# Altium schematic sheet EDU_High-Speed-Design_DDR3.SchDoc: DDR3
size 558 x 431 mm; Date: not used; ApprovedBy: not used; CheckedBy: not used; Author: not used; DrawnBy: not used; Organization: not used; Address4: not used; SheetNumber: 7; SheetTotal: 26; Time: not used; ImagePath: not used; Application_BuildNumber: not used
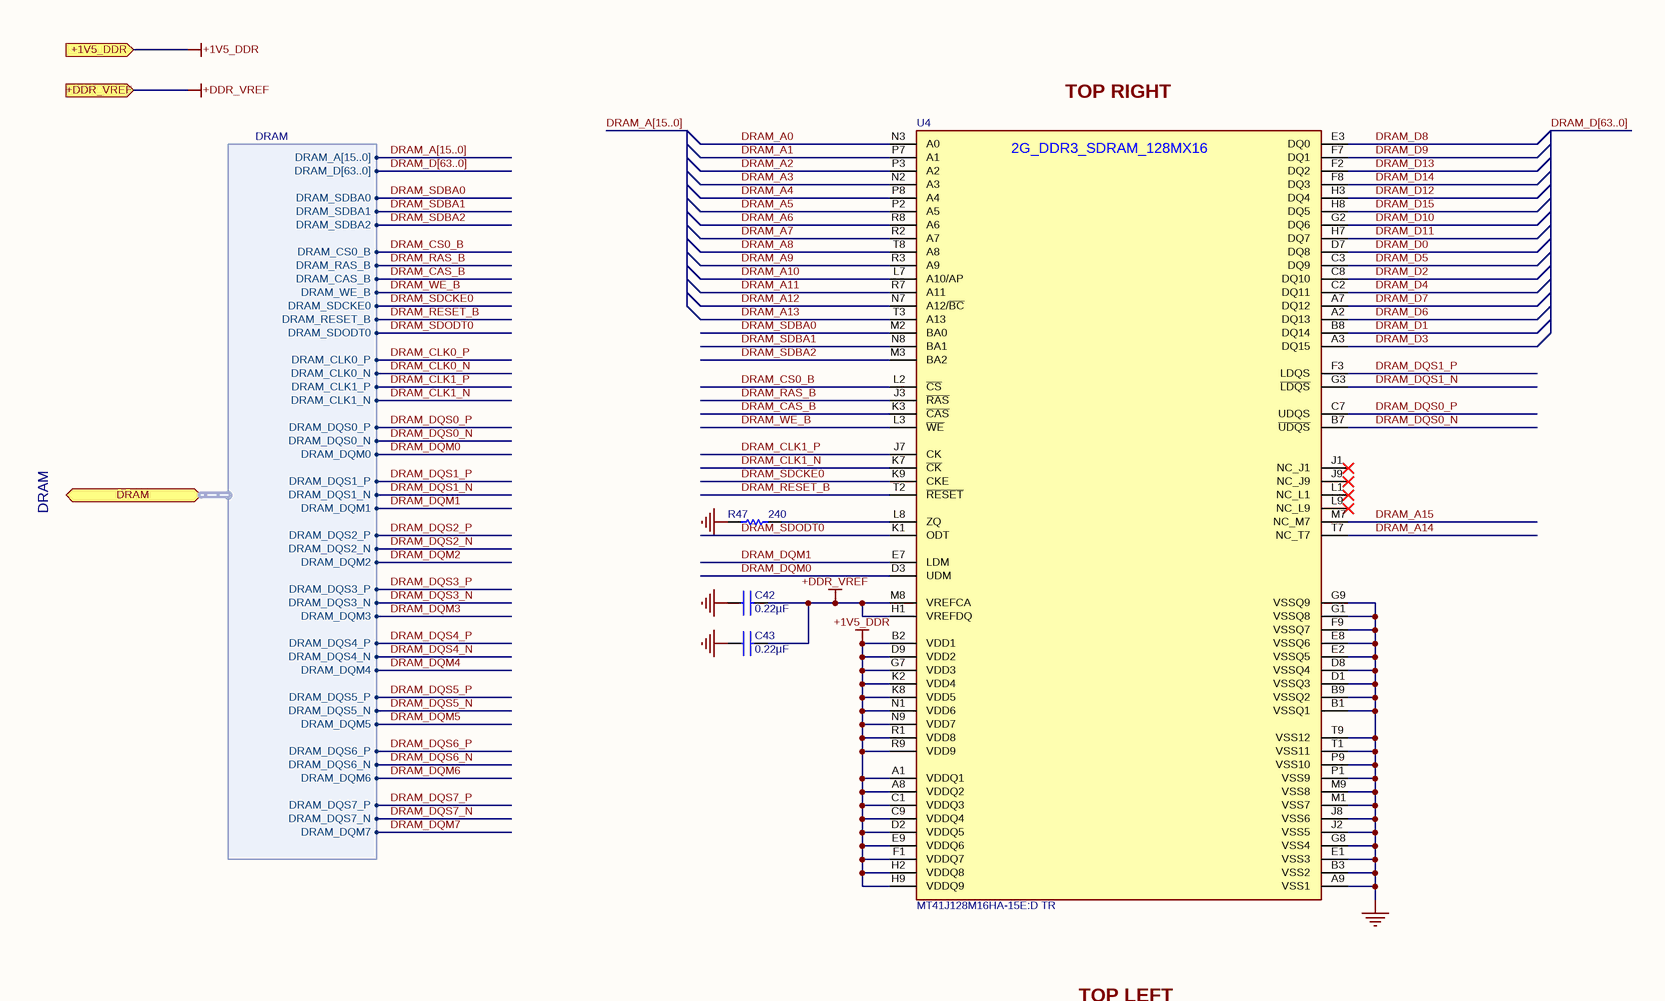
[diagram p0: EDU_High-Speed-Design_DDR3.SchDoc, top left]
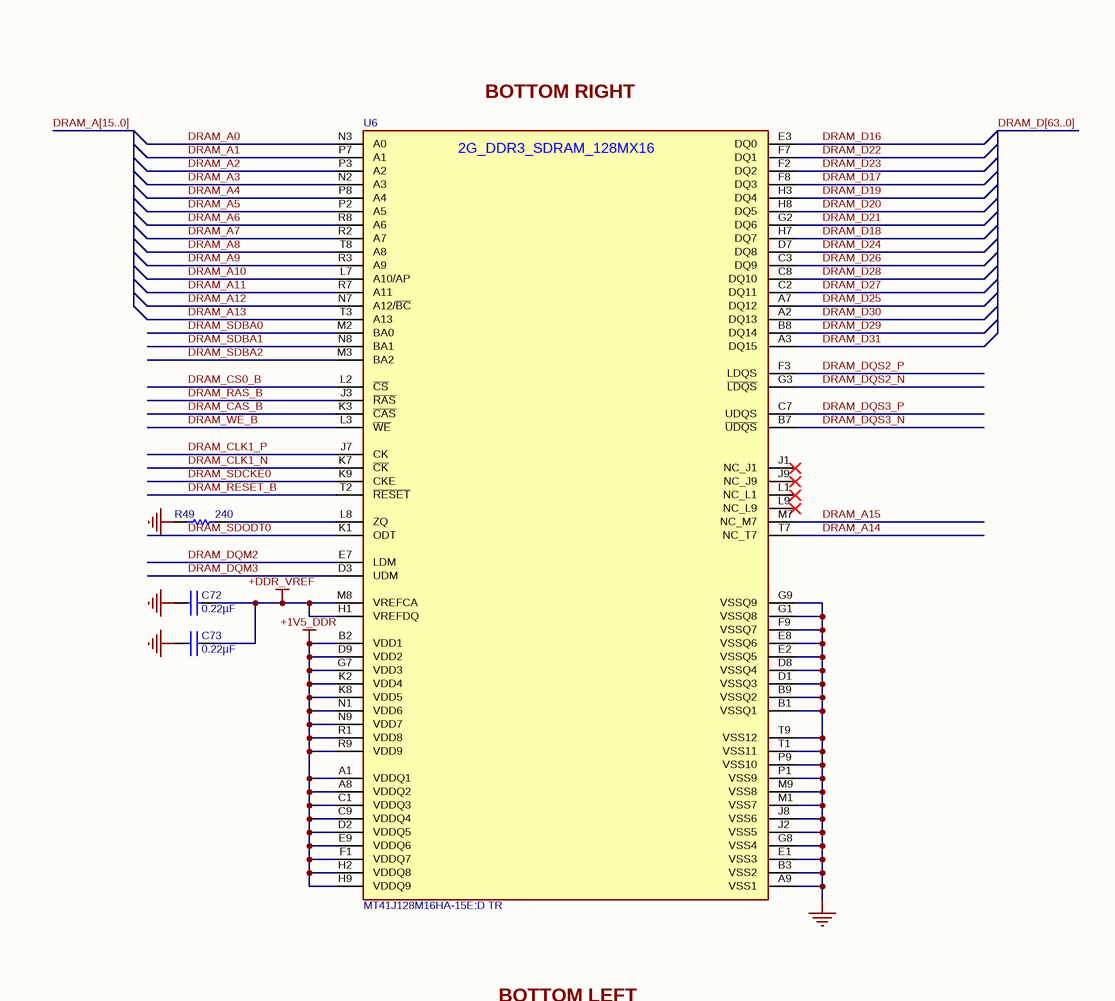
[diagram p1: EDU_High-Speed-Design_DDR3.SchDoc, top right]
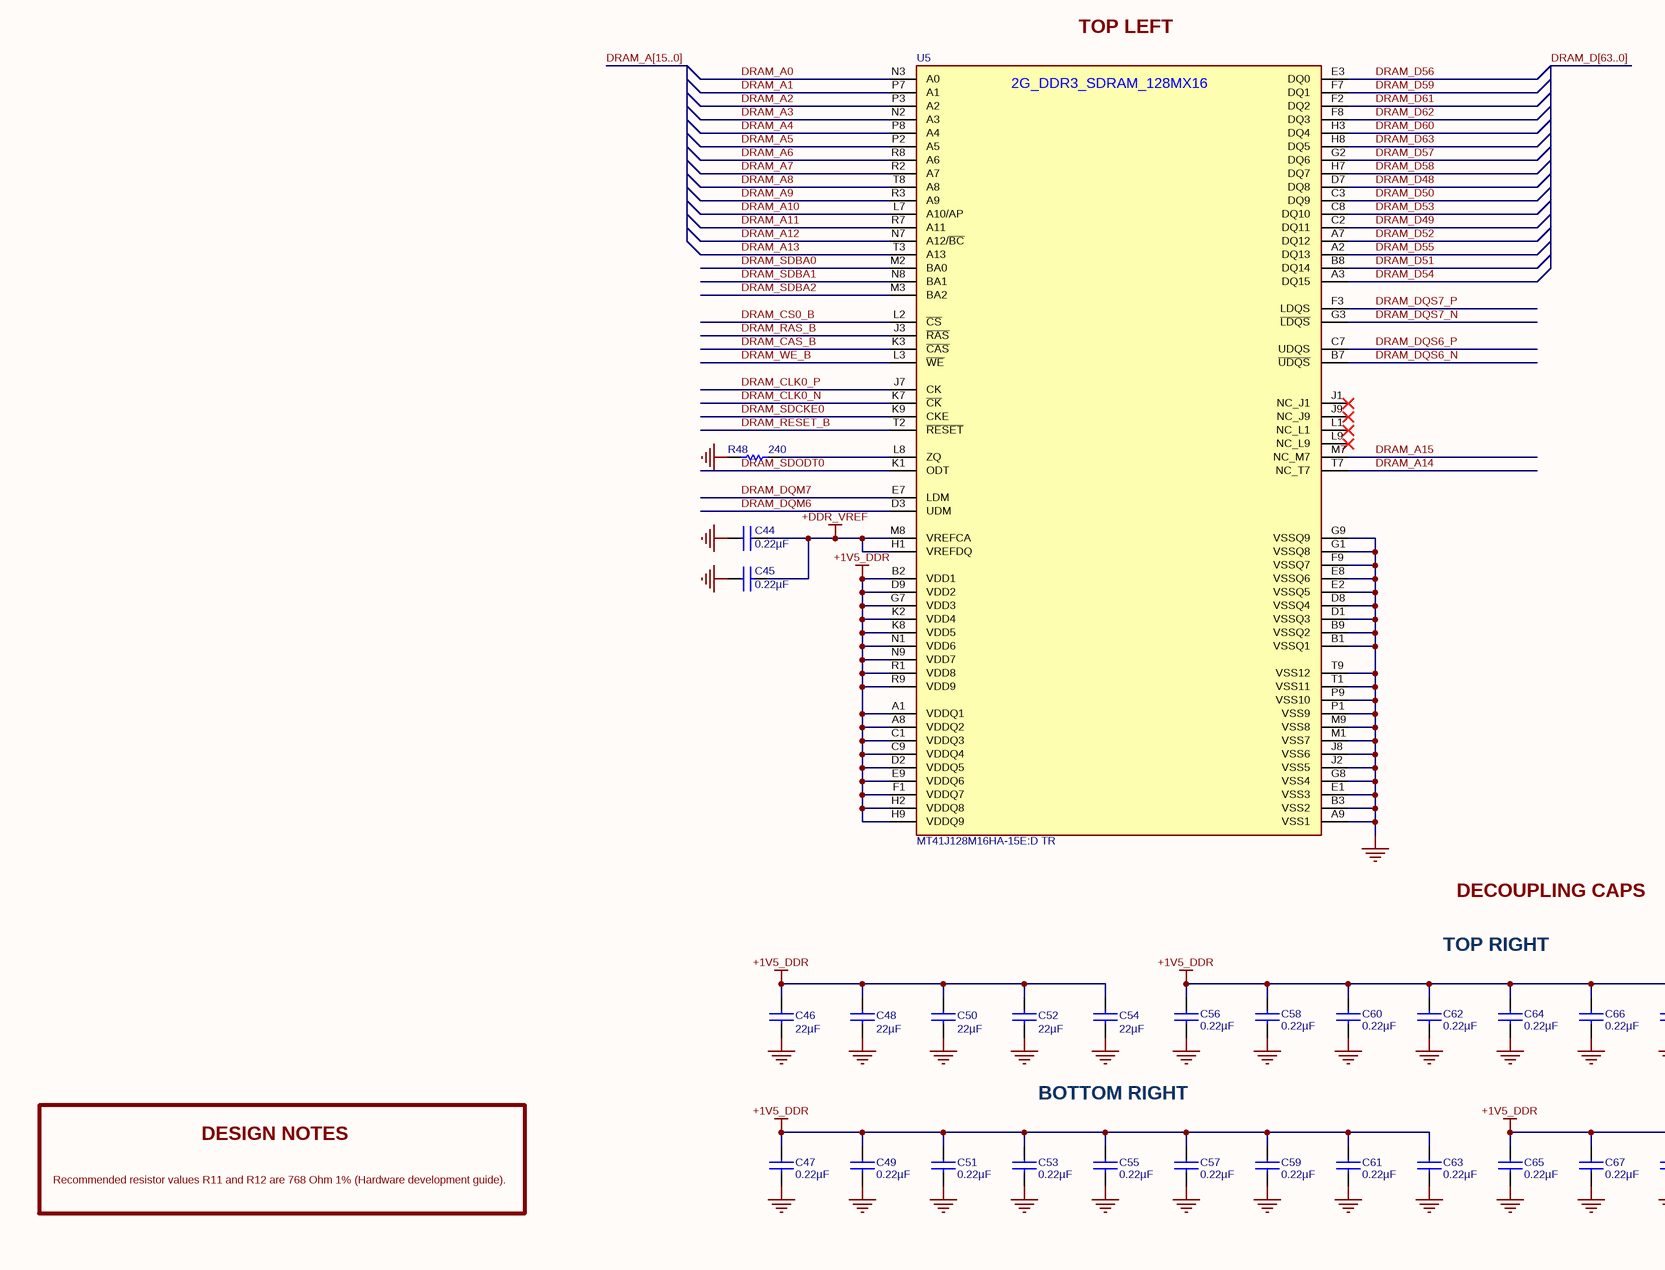
[diagram p2: EDU_High-Speed-Design_DDR3.SchDoc, bottom left]
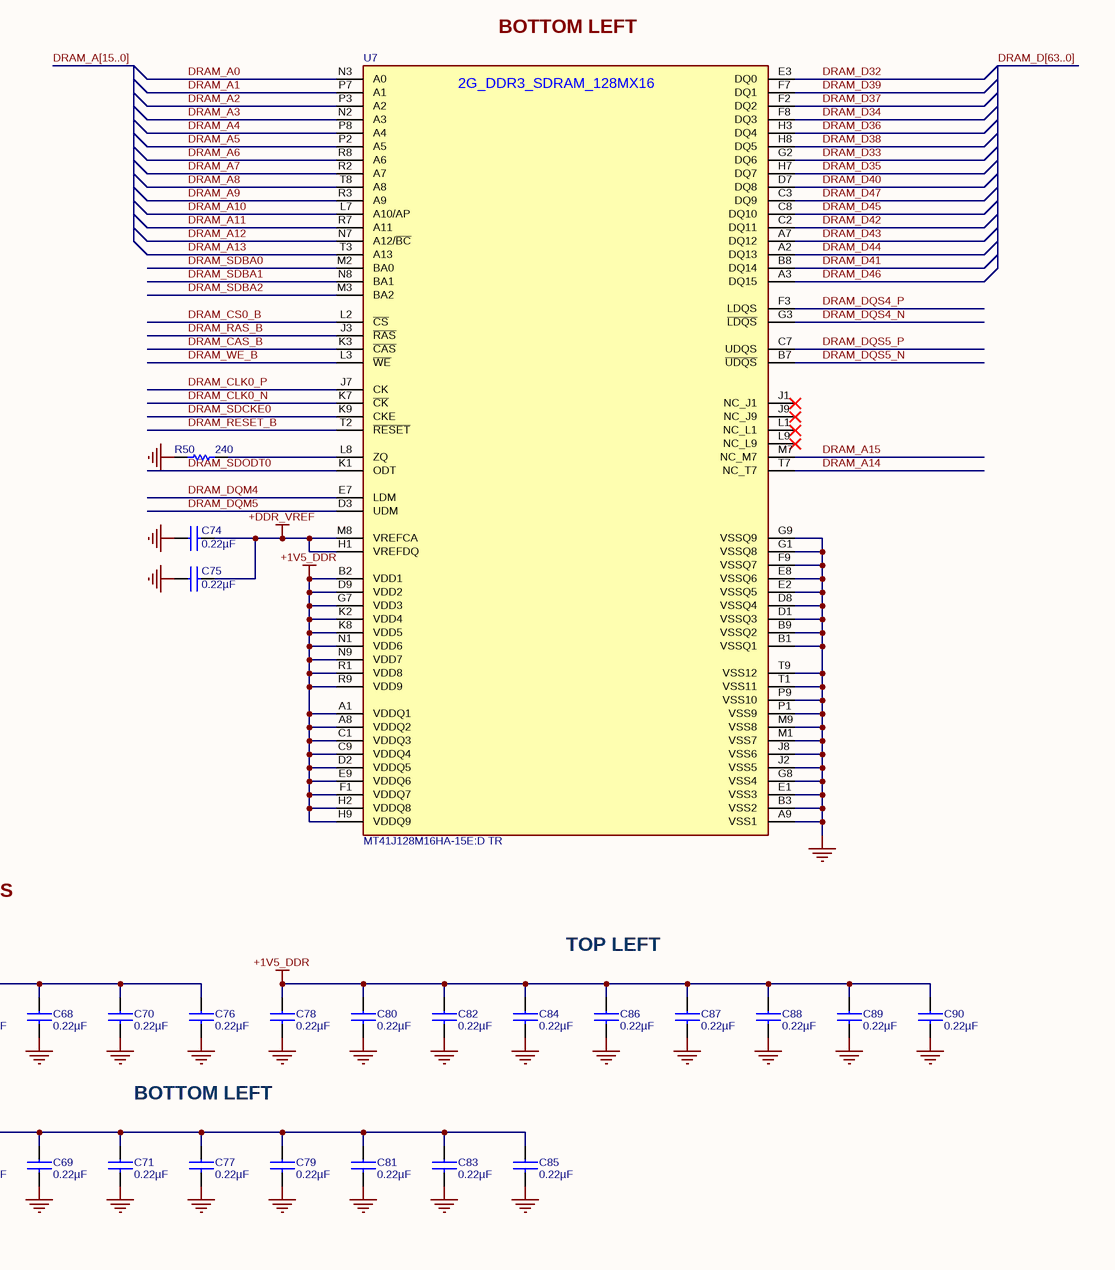
[diagram p3: EDU_High-Speed-Design_DDR3.SchDoc, bottom right]

## Parts
C42  0.22µF  [C0402]
C43  0.22µF  [C0402]
C44  0.22µF  [C0402]
C45  0.22µF  [C0402]
C46  22µF  [C0603]
C47  0.22µF  [C0402]
C48  22µF  [C0603]
C49  0.22µF  [C0402]
C50  22µF  [C0603]
C51  0.22µF  [C0402]
C52  22µF  [C0603]
C53  0.22µF  [C0402]
C54  22µF  [C0603]
C55  0.22µF  [C0402]
C56  0.22µF  [C0402]
C57  0.22µF  [C0402]
C58  0.22µF  [C0402]
C59  0.22µF  [C0402]
C60  0.22µF  [C0402]
C61  0.22µF  [C0402]
C62  0.22µF  [C0402]
C63  0.22µF  [C0402]
C64  0.22µF  [C0402]
C65  0.22µF  [C0402]
C66  0.22µF  [C0402]
C67  0.22µF  [C0402]
C68  0.22µF  [C0402]
C69  0.22µF  [C0402]
C70  0.22µF  [C0402]
C71  0.22µF  [C0402]
C72  0.22µF  [C0402]
C73  0.22µF  [C0402]
C74  0.22µF  [C0402]
C75  0.22µF  [C0402]
C76  0.22µF  [C0402]
C77  0.22µF  [C0402]
C78  0.22µF  [C0402]
C79  0.22µF  [C0402]
C80  0.22µF  [C0402]
C81  0.22µF  [C0402]
C82  0.22µF  [C0402]
C83  0.22µF  [C0402]
C84  0.22µF  [C0402]
C85  0.22µF  [C0402]
C86  0.22µF  [C0402]
C87  0.22µF  [C0402]
C88  0.22µF  [C0402]
C89  0.22µF  [C0402]
C90  0.22µF  [C0402]
R47  240  [R0402]
R48  240  [R0402]
R49  240  [R0402]
R50  240  [R0402]
U4  MT41J128M16HA-15E:D TR  [MT41J128M16HA-15E:D TR]
U5  MT41J128M16HA-15E:D TR  [MT41J128M16HA-15E:D TR]
U6  MT41J128M16HA-15E:D TR  [MT41J128M16HA-15E:D TR]
U7  MT41J128M16HA-15E:D TR  [MT41J128M16HA-15E:D TR]

## Ports
+1V5_DDR (in), +DDR_VREF (in), DRAM (bidir, harness DRAM)

## Harnesses
DRAM: DRAM_SDCKE0, DRAM_RESET_B, DRAM_CLK0_N, DRAM_CLK1_N, DRAM_CLK1_P, DRAM_SDODT0, DRAM_CS0_B, DRAM_RAS_B, DRAM_CAS_B, DRAM_WE_B, DRAM_A[15..0], DRAM_SDBA0, DRAM_SDBA1, DRAM_SDBA2, DRAM_CLK0_P, DRAM_D[63..0], DRAM_DQS0_P, DRAM_DQS0_N, DRAM_DQM0, DRAM_DQS1_P, DRAM_DQS1_N, DRAM_DQM1, DRAM_DQS2_P, DRAM_DQS2_N, DRAM_DQM2, DRAM_DQS3_P, DRAM_DQS3_N, DRAM_DQM3, DRAM_DQS4_P, DRAM_DQS4_N, DRAM_DQM4, DRAM_DQS5_P, DRAM_DQS5_N, DRAM_DQM5, DRAM_DQS6_P, DRAM_DQS6_N, DRAM_DQM6, DRAM_DQS7_P, DRAM_DQS7_N, DRAM_DQM7

## Nets
+1V5_DDR: C46.1 C47.1 C48.1 C49.1 C50.1 C51.1 C52.1 C53.1 C54.1 C55.1 C56.1 C57.1 C58.1 C59.1 C60.1 C61.1 C62.1 C63.1 C64.1 C65.1 C66.1 C67.1 C68.1 C69.1 C70.1 C71.1 C76.1 C77.1 C78.1 C79.1 C80.1 C81.1 C82.1 C83.1 C84.1 C85.1 C86.1 C87.1 C88.1 C89.1 C90.1 U4.A1(VDDQ1) U4.A8(VDDQ2) U4.B2(VDD1) U4.C1(VDDQ3) U4.C9(VDDQ4) U4.D2(VDDQ5) U4.D9(VDD2) U4.E9(VDDQ6) U4.F1(VDDQ7) U4.G7(VDD3) U4.H2(VDDQ8) U4.H9(VDDQ9) U4.K2(VDD4) U4.K8(VDD5) U4.N1(VDD6) U4.N9(VDD7) U4.R1(VDD8) U4.R9(VDD9) U5.A1(VDDQ1) U5.A8(VDDQ2) U5.B2(VDD1) U5.C1(VDDQ3) U5.C9(VDDQ4) U5.D2(VDDQ5) U5.D9(VDD2) U5.E9(VDDQ6) U5.F1(VDDQ7) U5.G7(VDD3) U5.H2(VDDQ8) U5.H9(VDDQ9) U5.K2(VDD4) U5.K8(VDD5) U5.N1(VDD6) U5.N9(VDD7) U5.R1(VDD8) U5.R9(VDD9) U6.A1(VDDQ1) U6.A8(VDDQ2) U6.B2(VDD1) U6.C1(VDDQ3) U6.C9(VDDQ4) U6.D2(VDDQ5) U6.D9(VDD2) U6.E9(VDDQ6) U6.F1(VDDQ7) U6.G7(VDD3) U6.H2(VDDQ8) U6.H9(VDDQ9) U6.K2(VDD4) U6.K8(VDD5) U6.N1(VDD6) U6.N9(VDD7) U6.R1(VDD8) U6.R9(VDD9) U7.A1(VDDQ1) U7.A8(VDDQ2) U7.B2(VDD1) U7.C1(VDDQ3) U7.C9(VDDQ4) U7.D2(VDDQ5) U7.D9(VDD2) U7.E9(VDDQ6) U7.F1(VDDQ7) U7.G7(VDD3) U7.H2(VDDQ8) U7.H9(VDDQ9) U7.K2(VDD4) U7.K8(VDD5) U7.N1(VDD6) U7.N9(VDD7) U7.R1(VDD8) U7.R9(VDD9) ; port +1V5_DDR
+DDR_VREF: C42.2 C43.2 C44.2 C45.2 C72.2 C73.2 C74.2 C75.2 U4.H1(VREFDQ) U4.M8(VREFCA) U5.H1(VREFDQ) U5.M8(VREFCA) U6.H1(VREFDQ) U6.M8(VREFCA) U7.H1(VREFDQ) U7.M8(VREFCA) ; port +DDR_VREF
GND: C42.1 C43.1 C44.1 C45.1 C46.2 C47.2 C48.2 C49.2 C50.2 C51.2 C52.2 C53.2 C54.2 C55.2 C56.2 C57.2 C58.2 C59.2 C60.2 C61.2 C62.2 C63.2 C64.2 C65.2 C66.2 C67.2 C68.2 C69.2 C70.2 C71.2 C72.1 C73.1 C74.1 C75.1 C76.2 C77.2 C78.2 C79.2 C80.2 C81.2 C82.2 C83.2 C84.2 C85.2 C86.2 C87.2 C88.2 C89.2 C90.2 R47.2 R48.2 R49.2 R50.2 U4.A9(VSS1) U4.B1(VSSQ1) U4.B3(VSS2) U4.B9(VSSQ2) U4.D1(VSSQ3) U4.D8(VSSQ4) U4.E1(VSS3) U4.E2(VSSQ5) U4.E8(VSSQ6) U4.F9(VSSQ7) U4.G1(VSSQ8) U4.G8(VSS4) U4.G9(VSSQ9) U4.J2(VSS5) U4.J8(VSS6) U4.M1(VSS7) U4.M9(VSS8) U4.P1(VSS9) U4.P9(VSS10) U4.T1(VSS11) U4.T9(VSS12) U5.A9(VSS1) U5.B1(VSSQ1) U5.B3(VSS2) U5.B9(VSSQ2) U5.D1(VSSQ3) U5.D8(VSSQ4) U5.E1(VSS3) U5.E2(VSSQ5) U5.E8(VSSQ6) U5.F9(VSSQ7) U5.G1(VSSQ8) U5.G8(VSS4) U5.G9(VSSQ9) U5.J2(VSS5) U5.J8(VSS6) U5.M1(VSS7) U5.M9(VSS8) U5.P1(VSS9) U5.P9(VSS10) U5.T1(VSS11) U5.T9(VSS12) U6.A9(VSS1) U6.B1(VSSQ1) U6.B3(VSS2) U6.B9(VSSQ2) U6.D1(VSSQ3) U6.D8(VSSQ4) U6.E1(VSS3) U6.E2(VSSQ5) U6.E8(VSSQ6) U6.F9(VSSQ7) U6.G1(VSSQ8) U6.G8(VSS4) U6.G9(VSSQ9) U6.J2(VSS5) U6.J8(VSS6) U6.M1(VSS7) U6.M9(VSS8) U6.P1(VSS9) U6.P9(VSS10) U6.T1(VSS11) U6.T9(VSS12) U7.A9(VSS1) U7.B1(VSSQ1) U7.B3(VSS2) U7.B9(VSSQ2) U7.D1(VSSQ3) U7.D8(VSSQ4) U7.E1(VSS3) U7.E2(VSSQ5) U7.E8(VSSQ6) U7.F9(VSSQ7) U7.G1(VSSQ8) U7.G8(VSS4) U7.G9(VSSQ9) U7.J2(VSS5) U7.J8(VSS6) U7.M1(VSS7) U7.M9(VSS8) U7.P1(VSS9) U7.P9(VSS10) U7.T1(VSS11) U7.T9(VSS12)
DRAM_A0: U4.N3(A0) U5.N3(A0) U6.N3(A0) U7.N3(A0)
DRAM_A1: U4.P7(A1) U5.P7(A1) U6.P7(A1) U7.P7(A1)
DRAM_A2: U4.P3(A2) U5.P3(A2) U6.P3(A2) U7.P3(A2)
DRAM_A3: U4.N2(A3) U5.N2(A3) U6.N2(A3) U7.N2(A3)
DRAM_A4: U4.P8(A4) U5.P8(A4) U6.P8(A4) U7.P8(A4)
DRAM_A5: U4.P2(A5) U5.P2(A5) U6.P2(A5) U7.P2(A5)
DRAM_A6: U4.R8(A6) U5.R8(A6) U6.R8(A6) U7.R8(A6)
DRAM_A7: U4.R2(A7) U5.R2(A7) U6.R2(A7) U7.R2(A7)
DRAM_A8: U4.T8(A8) U5.T8(A8) U6.T8(A8) U7.T8(A8)
DRAM_A9: U4.R3(A9) U5.R3(A9) U6.R3(A9) U7.R3(A9)
DRAM_A10: U4.L7(A10/AP) U5.L7(A10/AP) U6.L7(A10/AP) U7.L7(A10/AP)
DRAM_A11: U4.R7(A11) U5.R7(A11) U6.R7(A11) U7.R7(A11)
DRAM_A12: U4.N7(A12/~{BC}) U5.N7(A12/~{BC}) U6.N7(A12/~{BC}) U7.N7(A12/~{BC})
DRAM_A13: U4.T3(A13) U5.T3(A13) U6.T3(A13) U7.T3(A13)
DRAM_A14: U4.T7(NC_T7) U5.T7(NC_T7) U6.T7(NC_T7) U7.T7(NC_T7)
DRAM_A15: U4.M7(NC_M7) U5.M7(NC_M7) U6.M7(NC_M7) U7.M7(NC_M7)
DRAM_CAS_B: U4.K3(~{CAS}) U5.K3(~{CAS}) U6.K3(~{CAS}) U7.K3(~{CAS}) ; port DRAM.DRAM_CAS_B
DRAM_CLK0_N: U5.K7(~{CK}) U7.K7(~{CK}) ; port DRAM.DRAM_CLK0_N
DRAM_CLK0_P: U5.J7(CK) U7.J7(CK) ; port DRAM.DRAM_CLK0_P
DRAM_CLK1_N: U4.K7(~{CK}) U6.K7(~{CK}) ; port DRAM.DRAM_CLK1_N
DRAM_CLK1_P: U4.J7(CK) U6.J7(CK) ; port DRAM.DRAM_CLK1_P
DRAM_CS0_B: U4.L2(~{CS}) U5.L2(~{CS}) U6.L2(~{CS}) U7.L2(~{CS}) ; port DRAM.DRAM_CS0_B
DRAM_D0: U4.D7(DQ8)
DRAM_D1: U4.B8(DQ14)
DRAM_D2: U4.C8(DQ10)
DRAM_D3: U4.A3(DQ15)
DRAM_D4: U4.C2(DQ11)
DRAM_D5: U4.C3(DQ9)
DRAM_D6: U4.A2(DQ13)
DRAM_D7: U4.A7(DQ12)
DRAM_D8: U4.E3(DQ0)
DRAM_D9: U4.F7(DQ1)
DRAM_D10: U4.G2(DQ6)
DRAM_D11: U4.H7(DQ7)
DRAM_D12: U4.H3(DQ4)
DRAM_D13: U4.F2(DQ2)
DRAM_D14: U4.F8(DQ3)
DRAM_D15: U4.H8(DQ5)
DRAM_D16: U6.E3(DQ0)
DRAM_D17: U6.F8(DQ3)
DRAM_D18: U6.H7(DQ7)
DRAM_D19: U6.H3(DQ4)
DRAM_D20: U6.H8(DQ5)
DRAM_D21: U6.G2(DQ6)
DRAM_D22: U6.F7(DQ1)
DRAM_D23: U6.F2(DQ2)
DRAM_D24: U6.D7(DQ8)
DRAM_D25: U6.A7(DQ12)
DRAM_D26: U6.C3(DQ9)
DRAM_D27: U6.C2(DQ11)
DRAM_D28: U6.C8(DQ10)
DRAM_D29: U6.B8(DQ14)
DRAM_D30: U6.A2(DQ13)
DRAM_D31: U6.A3(DQ15)
DRAM_D32: U7.E3(DQ0)
DRAM_D33: U7.G2(DQ6)
DRAM_D34: U7.F8(DQ3)
DRAM_D35: U7.H7(DQ7)
DRAM_D36: U7.H3(DQ4)
DRAM_D37: U7.F2(DQ2)
DRAM_D38: U7.H8(DQ5)
DRAM_D39: U7.F7(DQ1)
DRAM_D40: U7.D7(DQ8)
DRAM_D41: U7.B8(DQ14)
DRAM_D42: U7.C2(DQ11)
DRAM_D43: U7.A7(DQ12)
DRAM_D44: U7.A2(DQ13)
DRAM_D45: U7.C8(DQ10)
DRAM_D46: U7.A3(DQ15)
DRAM_D47: U7.C3(DQ9)
DRAM_D48: U5.D7(DQ8)
DRAM_D49: U5.C2(DQ11)
DRAM_D50: U5.C3(DQ9)
DRAM_D51: U5.B8(DQ14)
DRAM_D52: U5.A7(DQ12)
DRAM_D53: U5.C8(DQ10)
DRAM_D54: U5.A3(DQ15)
DRAM_D55: U5.A2(DQ13)
DRAM_D56: U5.E3(DQ0)
DRAM_D57: U5.G2(DQ6)
DRAM_D58: U5.H7(DQ7)
DRAM_D59: U5.F7(DQ1)
DRAM_D60: U5.H3(DQ4)
DRAM_D61: U5.F2(DQ2)
DRAM_D62: U5.F8(DQ3)
DRAM_D63: U5.H8(DQ5)
DRAM_DQM0: U4.D3(UDM) ; port DRAM.DRAM_DQM0
DRAM_DQM1: U4.E7(LDM) ; port DRAM.DRAM_DQM1
DRAM_DQM2: U6.E7(LDM) ; port DRAM.DRAM_DQM2
DRAM_DQM3: U6.D3(UDM) ; port DRAM.DRAM_DQM3
DRAM_DQM4: U7.E7(LDM) ; port DRAM.DRAM_DQM4
DRAM_DQM5: U7.D3(UDM) ; port DRAM.DRAM_DQM5
DRAM_DQM6: U5.D3(UDM) ; port DRAM.DRAM_DQM6
DRAM_DQM7: U5.E7(LDM) ; port DRAM.DRAM_DQM7
DRAM_DQS0_N: U4.B7(~{UDQS}) ; port DRAM.DRAM_DQS0_N
DRAM_DQS0_P: U4.C7(UDQS) ; port DRAM.DRAM_DQS0_P
DRAM_DQS1_N: U4.G3(~{LDQS}) ; port DRAM.DRAM_DQS1_N
DRAM_DQS1_P: U4.F3(LDQS) ; port DRAM.DRAM_DQS1_P
DRAM_DQS2_N: U6.G3(~{LDQS}) ; port DRAM.DRAM_DQS2_N
DRAM_DQS2_P: U6.F3(LDQS) ; port DRAM.DRAM_DQS2_P
DRAM_DQS3_N: U6.B7(~{UDQS}) ; port DRAM.DRAM_DQS3_N
DRAM_DQS3_P: U6.C7(UDQS) ; port DRAM.DRAM_DQS3_P
DRAM_DQS4_N: U7.G3(~{LDQS}) ; port DRAM.DRAM_DQS4_N
DRAM_DQS4_P: U7.F3(LDQS) ; port DRAM.DRAM_DQS4_P
DRAM_DQS5_N: U7.B7(~{UDQS}) ; port DRAM.DRAM_DQS5_N
DRAM_DQS5_P: U7.C7(UDQS) ; port DRAM.DRAM_DQS5_P
DRAM_DQS6_N: U5.B7(~{UDQS}) ; port DRAM.DRAM_DQS6_N
DRAM_DQS6_P: U5.C7(UDQS) ; port DRAM.DRAM_DQS6_P
DRAM_DQS7_N: U5.G3(~{LDQS}) ; port DRAM.DRAM_DQS7_N
DRAM_DQS7_P: U5.F3(LDQS) ; port DRAM.DRAM_DQS7_P
DRAM_RAS_B: U4.J3(~{RAS}) U5.J3(~{RAS}) U6.J3(~{RAS}) U7.J3(~{RAS}) ; port DRAM.DRAM_RAS_B
DRAM_RESET_B: U4.T2(~{RESET}) U5.T2(~{RESET}) U6.T2(~{RESET}) U7.T2(~{RESET}) ; port DRAM.DRAM_RESET_B
DRAM_SDBA0: U4.M2(BA0) U5.M2(BA0) U6.M2(BA0) U7.M2(BA0) ; port DRAM.DRAM_SDBA0
DRAM_SDBA1: U4.N8(BA1) U5.N8(BA1) U6.N8(BA1) U7.N8(BA1) ; port DRAM.DRAM_SDBA1
DRAM_SDBA2: U4.M3(BA2) U5.M3(BA2) U6.M3(BA2) U7.M3(BA2) ; port DRAM.DRAM_SDBA2
DRAM_SDCKE0: U4.K9(CKE) U5.K9(CKE) U6.K9(CKE) U7.K9(CKE) ; port DRAM.DRAM_SDCKE0
DRAM_SDODT0: U4.K1(ODT) U5.K1(ODT) U6.K1(ODT) U7.K1(ODT) ; port DRAM.DRAM_SDODT0
DRAM_WE_B: U4.L3(~{WE}) U5.L3(~{WE}) U6.L3(~{WE}) U7.L3(~{WE}) ; port DRAM.DRAM_WE_B
NetR47_1: R47.1 U4.L8(ZQ)
NetR48_1: R48.1 U5.L8(ZQ)
NetR49_1: R49.1 U6.L8(ZQ)
NetR50_1: R50.1 U7.L8(ZQ)

Not connected (* = marked no-connect by the designer): U4 J1(NC_J1)* J9(NC_J9)* L1(NC_L1)* L9(NC_L9)*; U5 J1(NC_J1)* J9(NC_J9)* L1(NC_L1)* L9(NC_L9)*; U6 J1(NC_J1)* J9(NC_J9)* L1(NC_L1)* L9(NC_L9)*; U7 J1(NC_J1)* J9(NC_J9)* L1(NC_L1)* L9(NC_L9)*

## Buses and harness runs
bus DRAM_A[15..0]
bus DRAM_D[63..0]

## Notes on the sheet
- (near U4) TOP RIGHT
- (near U6) BOTTOM RIGHT
- DRAM
- (near U5) TOP LEFT
- (near U7) BOTTOM LEFT
- DECOUPLING CAPS
- TOP RIGHT
- TOP LEFT
- BOTTOM RIGHT
- BOTTOM LEFT
- DESIGN NOTES
- Recommended resistor values R11 and R12 are 768 Ohm 1% (Hardware development guide).
- Title:
- Date:
- Size C
- Project:
- Number:
- Time:
- Sheet
- Revision
- of
- Engineer:
- File:
- (in symbol MT41J128M16HA-15E:D TR) 2G_DDR3_SDRAM_128MX16

## Library data of the parts
C42-C45 C47 C49 C51 C53 C55-C90 = C1005X5R1E224M: CAP CER .22UF 25V X5R 20% 0402; Manufacturer 1: TDK Corporation; Capacitance: 0.22µF; Manufacturer Part Number 1: C1005X5R1E224M; Voltage: 25V; Supplier 1: Digi-Key; Supplier Part Number 1: 445-5945-1-ND; ComponentLink1URL: http://www.tdk.co.jp/tefe02/e412_c.pdf; ComponentLink1Description: http://www.tdk.co.jp/tefe02/e412_c.pdf
C46 C48 C50 C52 C54 = GRM188R60G226MEA0L: CAP CER 22UF 4V 20% X5R 0603; Manufacturer 1: Murata Electronics North America; Supplier 1: Digi-Key; Supplier Part Number 1: 490-5526-1-ND; Manufacturer Part Number 1: GRM188R60G226MEA0L; Capacitance: 22µF; Voltage: 4V; ComponentLink1URL: http://www.murata.com/products/catalog/pdf/c02e.pdf; ComponentLink1Description: http://www.murata.com/products/catalog/pdf/c02e.pdf
R47-R50 = RMCF0402FT240R: RES TF 240 OHM 1% 0.0625W 0402; Manufacturer 1: Stackpole Electronics Inc; Manufacturer Part Number 1: RMCF0402FT240R; Resistance: 240; Supplier 1: Digi-Key; Supplier Part Number 1: RMCF0402FT240RCT-ND; ComponentLink1URL: http://www.seielect.com/Catalog/SEI-RMCF.pdf; ComponentLink1Description: http://www.seielect.com/Catalog/SEI-RMCF.pdf
U4-U7 = MT41J128M16HA-15E:D TR: IC DDR3 SDRAM 2GBIT 667MHZ 96BGA; Manufacturer 1: Micron Technology Inc; Supplier 1: Digi-Key; Manufacturer Part Number 1: MT41J128M16HA-15E:D TR; ComponentLink1URL: http://www.micron.com/~/media/Documents/Products/Data%20Sheet/DRAM/2Gb_DDR3_SDRAM.pdf; ComponentLink1Description: http://www.micron.com/~/media/Documents/Products/Data%20Sheet/DRAM/2Gb_DDR3_SDRAM.pdf; Supplier Part Number 1: 557-1493-1-ND